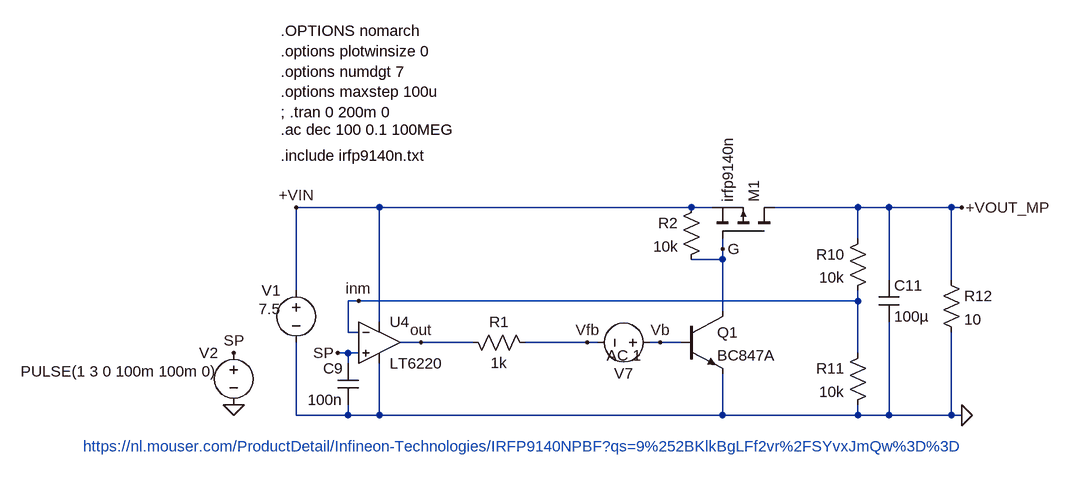
[diagram p0: schematic PMOS_lin_reg - V3.asc]
PMOS_lin_reg - V3.asc, the LTspice schematic file:
Version 4
SHEET 1 4944 2476
WIRE 816 -2032 688 -2032
WIRE 1296 -2032 816 -2032
WIRE 1328 -2032 1296 -2032
WIRE 1552 -2032 1424 -2032
WIRE 1600 -2032 1552 -2032
WIRE 1696 -2032 1600 -2032
WIRE 1712 -2032 1696 -2032
WIRE 1552 -1984 1552 -2032
WIRE 1344 -1968 1344 -1984
WIRE 1344 -1952 1344 -1968
WIRE 1344 -1952 1296 -1952
WIRE 1600 -1920 1600 -2032
WIRE 1696 -1920 1696 -2032
WIRE 688 -1904 688 -2032
WIRE 784 -1888 768 -1888
WIRE 1552 -1888 1552 -1904
WIRE 1552 -1888 784 -1888
WIRE 1344 -1872 1344 -1952
WIRE 816 -1856 816 -2032
WIRE 768 -1840 768 -1888
WIRE 784 -1840 768 -1840
WIRE 880 -1824 848 -1824
WIRE 960 -1824 880 -1824
WIRE 1136 -1824 1040 -1824
WIRE 1152 -1824 1136 -1824
WIRE 1248 -1824 1232 -1824
WIRE 1280 -1824 1248 -1824
WIRE 768 -1808 752 -1808
WIRE 784 -1808 768 -1808
WIRE 1552 -1808 1552 -1888
WIRE 768 -1792 768 -1808
WIRE 688 -1712 688 -1824
WIRE 768 -1712 768 -1728
WIRE 768 -1712 688 -1712
WIRE 816 -1712 816 -1792
WIRE 816 -1712 768 -1712
WIRE 1344 -1712 1344 -1776
WIRE 1344 -1712 816 -1712
WIRE 1552 -1712 1552 -1728
WIRE 1552 -1712 1344 -1712
WIRE 1600 -1712 1600 -1856
WIRE 1600 -1712 1552 -1712
WIRE 1696 -1712 1696 -1840
WIRE 1696 -1712 1600 -1712
WIRE 1712 -1712 1696 -1712
FLAG 688 -2032 +VIN
FLAG 592 -1728 0
FLAG 592 -1808 SP
FLAG 1712 -1712 0
FLAG 1712 -2032 +VOUT_MP
FLAG 752 -1808 SP
FLAG 1344 -1968 G
FLAG 1248 -1824 Vb
FLAG 1136 -1824 Vfb
FLAG 784 -1888 inm
FLAG 880 -1824 out
DATAFLAG 1648 -2032 "round($/1m)*1m"
DATAFLAG 768 -2032 "round($/1m)*1m"
DATAFLAG 1072 -1824 "round($/1m)*1m"
DATAFLAG 1040 -1888 "round($/1m)*1m"
SYMBOL voltage 688 -1920 M0
WINDOW 123 0 0 Left 0
WINDOW 39 0 0 Left 0
WINDOW 3 24 44 Left 2
SYMATTR Value 7.5
SYMATTR InstName V1
SYMBOL voltage 592 -1824 M0
WINDOW 123 0 0 Left 0
WINDOW 39 0 0 Left 0
WINDOW 3 24 44 Left 2
SYMATTR Value PULSE(1 3 0 100m 100m 0)
SYMATTR InstName V2
SYMBOL cap 784 -1792 M0
SYMATTR InstName C9
SYMATTR Value 100n
SYMBOL voltage 1248 -1824 M270
WINDOW 0 -32 56 VBottom 2
WINDOW 3 32 56 VTop 2
WINDOW 123 -4 56 VBottom 2
WINDOW 39 0 0 Left 0
SYMATTR InstName V7
SYMATTR Value ""
SYMATTR Value2 AC 1
SYMBOL cap 1584 -1920 R0
SYMATTR InstName C11
SYMATTR Value 100µ
SYMATTR SpiceLine Rser=10m
SYMBOL res 1568 -2000 M0
SYMATTR InstName R10
SYMATTR Value 10k
SYMBOL res 1568 -1824 M0
SYMATTR InstName R11
SYMATTR Value 10k
SYMBOL OpAmps\\LT6220 816 -1824 R0
SYMATTR InstName U4
SYMBOL res 1680 -1936 R0
SYMATTR InstName R12
SYMATTR Value 10
SYMBOL npn 1280 -1872 R0
SYMATTR InstName Q1
SYMATTR Value BC847A
SYMBOL res 1056 -1808 M270
WINDOW 0 32 56 VTop 2
WINDOW 3 0 56 VBottom 2
SYMATTR InstName R1
SYMATTR Value 1k
SYMBOL pmos 1424 -1984 M270
SYMATTR InstName M1
SYMATTR Value irfp9140n
SYMATTR Prefix X
SYMBOL res 1312 -2048 M0
SYMATTR InstName R2
SYMATTR Value 10k
TEXT 664 -2304 Left 2 !.OPTIONS nomarch\n.options plotwinsize 0\n.options numdgt 7\n.options maxstep 100u\n; .tran 0 200m 0
TEXT 664 -2152 Left 2 !.ac dec 100 0.1 100MEG
TEXT 664 -2112 Left 2 !.include irfp9140n.txt
TEXT 360 -1664 Left 2 ;https://nl.mouser.com/ProductDetail/Infineon-Technologies/IRFP9140NPBF?qs=9%252BKlkBgLFf2vr%2FSYvxJmQw%3D%3D

The netlist it stands for:
* PMOS_lin_reg - V3.asc
V1 +VIN 0 7.5
V2 SP 0 PULSE(1 3 0 100m 100m 0)
C9 SP 0 100n
V7 Vb Vfb AC 1
C11 +VOUT_MP 0 100µ Rser=10m
R10 +VOUT_MP inm 10k
R11 inm 0 10k
XU4 SP inm +VIN 0 out LT6220  ; pins In+ In- V+ V- OUT
R12 +VOUT_MP 0 10
Q1 G Vb 0 0 BC847A
R1 Vfb out 1k
XM1 +VOUT_MP G +VIN irfp9140n  ; pins D G S
R2 +VIN G 10k
.model NPN NPN
.model PNP PNP
.lib standard.bjt
.OPTIONS nomarch
.options plotwinsize 0
.options numdgt 7
.options maxstep 100u
; .tran 0 200m 0
.ac dec 100 0.1 100MEG
.include irfp9140n.txt
* https://nl.mouser.com/ProductDetail/Infineon-Technologies/IRFP9140NPBF?qs=9%252BKlkBgLFf2vr%2FSYvxJmQw%3D%3D
.lib LTC4.lib
.backanno
.end